# EAGLE schematic Controle_Des_Moteurs (EAGLE 9.5.2)
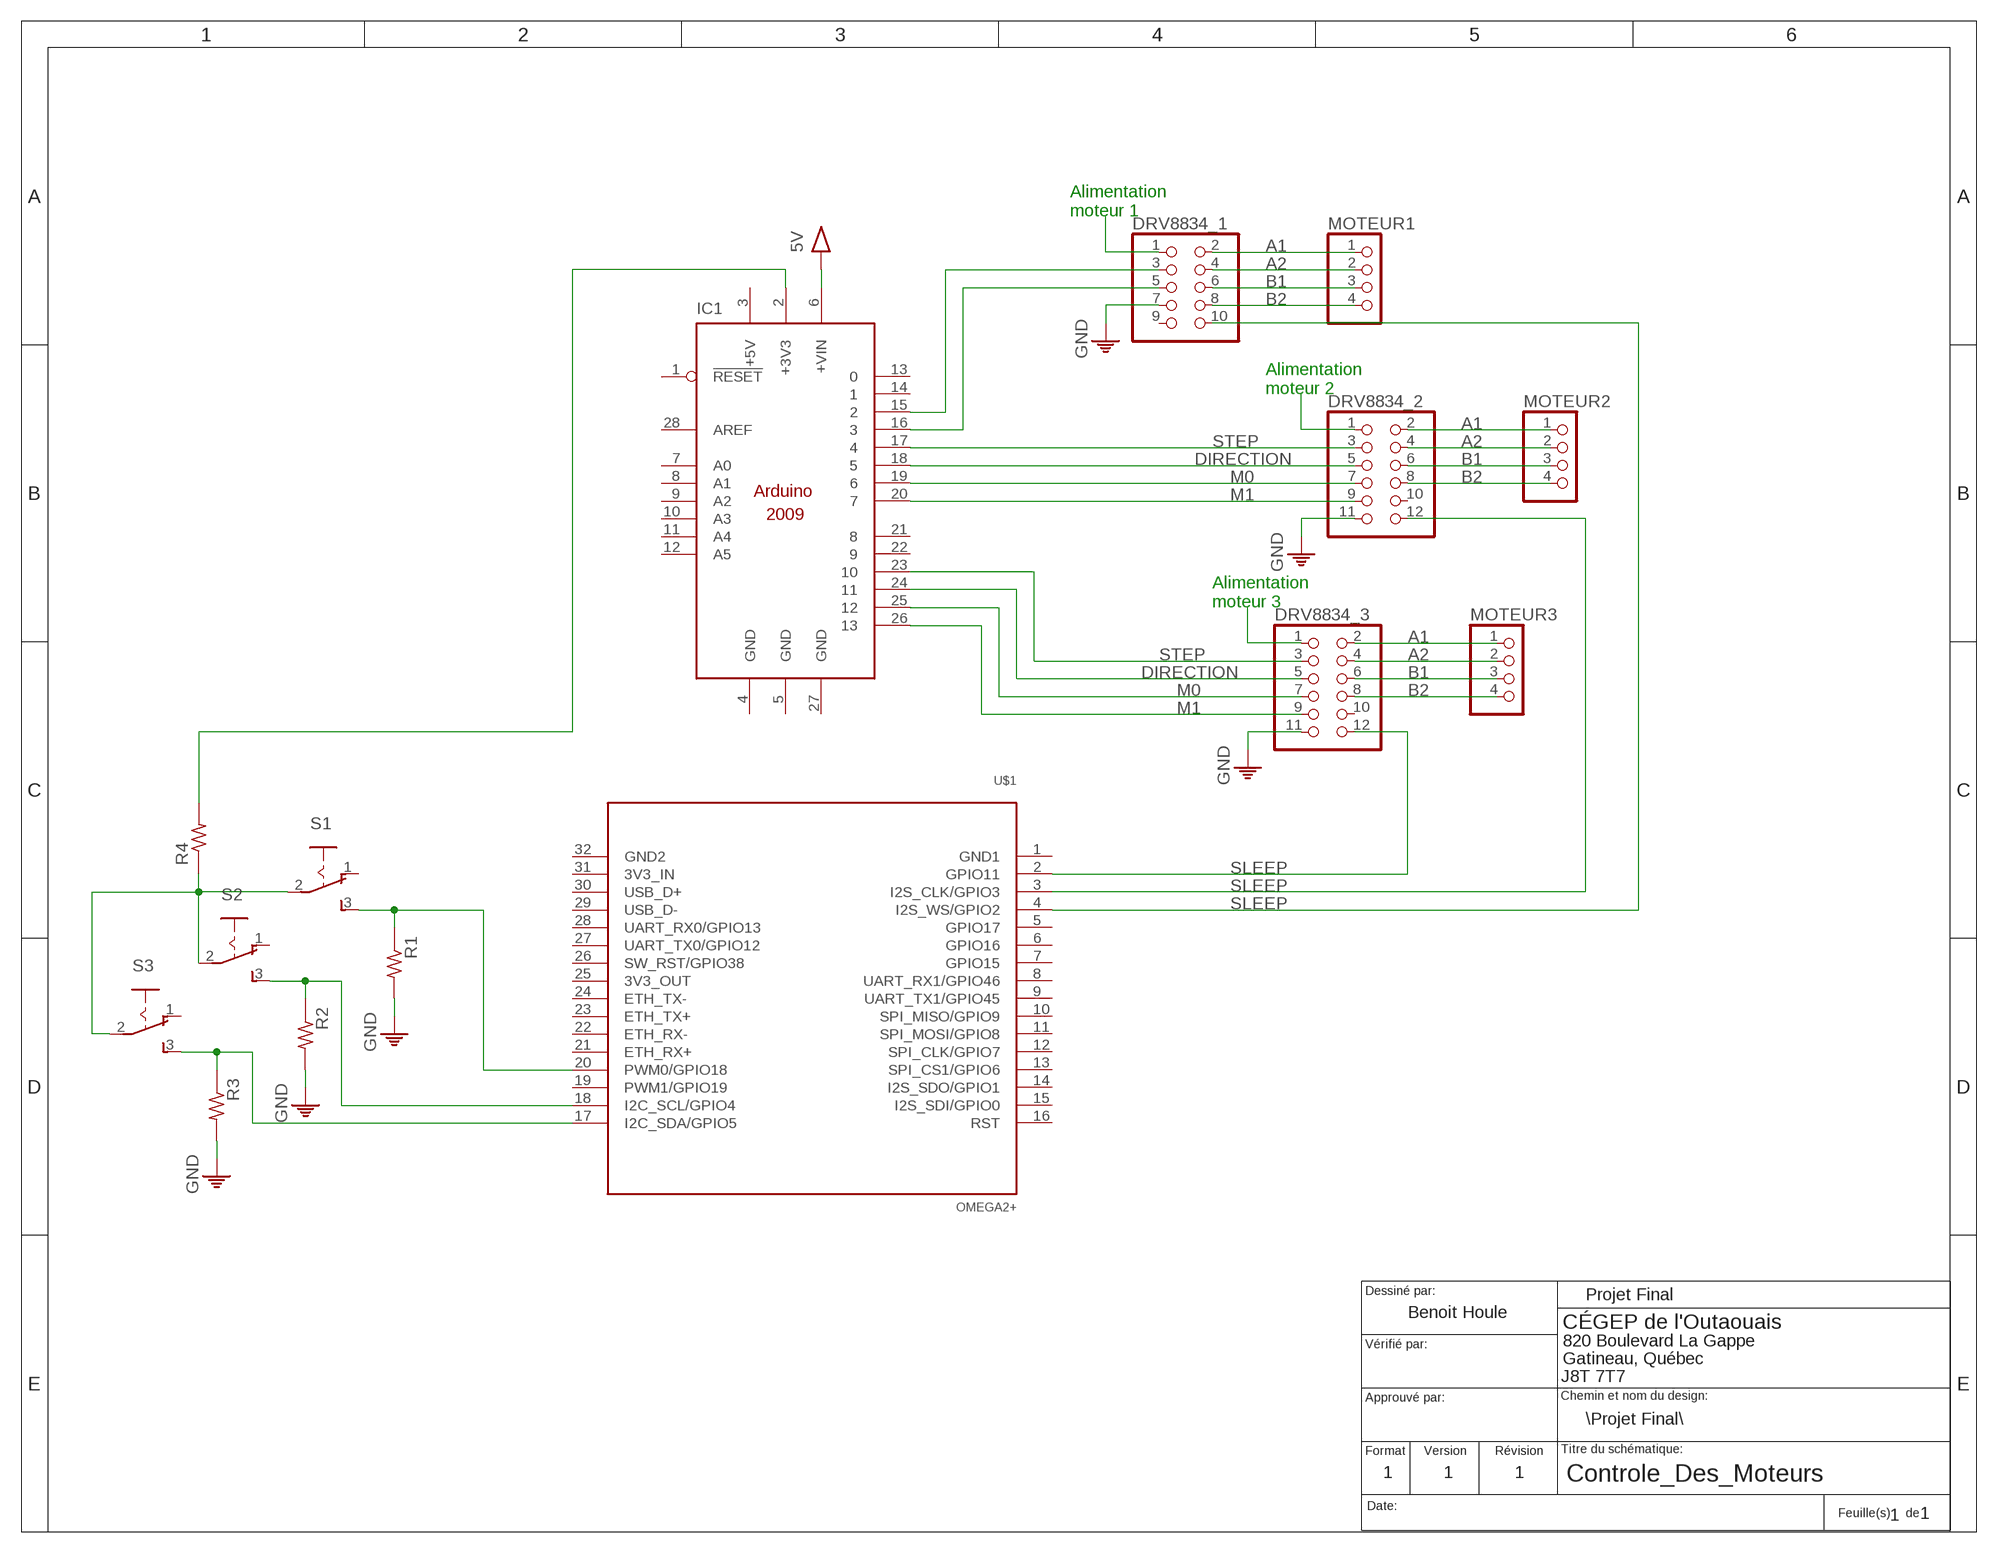
[diagram p0: schematic, sheet 1]

## Parts
DRV8834_1  PINHD-2X5  [2X05]
DRV8834_2  PINHD-2X6  [2X06]
DRV8834_3  PINHD-2X6  [2X06]
FRAME1  CARTOUCHE_TGÉ  [CARTOUCHE]
IC1  ARDUINO2009_10  [ARDUINO2009]
MOTEUR1  PINHD-1X4  [1X04]
MOTEUR2  PINHD-1X4  [1X04]
MOTEUR3  PINHD-1X4  [1X04]
R1  RMELF0207R  [MINI_MELF-0207R]
R2  RMELF0207R  [MINI_MELF-0207R]
R3  RMELF0207R  [MINI_MELF-0207R]
R4  RMELF0207R  [MINI_MELF-0207R]
S1  255SB  [255SB]
S2  255SB  [255SB]
S3  255SB  [255SB]
U$1  OMEGA2+  [OMEGA2_PADS]

## Nets
A1: DRV8834_1.2 DRV8834_2.2 DRV8834_3.2 MOTEUR1.1 MOTEUR2.1 MOTEUR3.1
A2: DRV8834_1.4 DRV8834_2.4 DRV8834_3.4 MOTEUR1.2 MOTEUR2.2 MOTEUR3.2
B1: DRV8834_1.6 DRV8834_2.6 DRV8834_3.6 MOTEUR1.3 MOTEUR2.3 MOTEUR3.3
B2: DRV8834_1.8 DRV8834_2.8 DRV8834_3.8 MOTEUR1.4 MOTEUR2.4 MOTEUR3.4
DIRECTION: DRV8834_2.5 DRV8834_3.5 IC1.18 IC1.24
M0: DRV8834_2.7 DRV8834_3.7 IC1.19 IC1.25
M1: DRV8834_2.9 DRV8834_3.9 IC1.20 IC1.26
N$1: DRV8834_1.1
N$2: DRV8834_2.1
N$3: DRV8834_1.3 IC1.15
N$4: DRV8834_1.5 IC1.16
N$5: DRV8834_3.1
N$6: R1.1 S1.3(S) U$1.20(PWM0/GPIO18)
N$7: R2.1 S2.3(S) U$1.18(I2C_SCL/GPIO4)
N$8: R3.1 S3.3(S) U$1.17(I2C_SDA/GPIO5)
N$9: R4.1 S1.2(P) S2.2(P) S3.2(P)
N$10: IC1.2(+3V3) R4.2
PE: DRV8834_1.7 DRV8834_2.11 DRV8834_3.11 R1.2 R2.2 R3.2 ; supply symbol labelled GND
SLEEP: DRV8834_1.10 DRV8834_2.12 DRV8834_3.12 U$1.2(GPIO11) U$1.3(I2S_CLK/GPIO3) U$1.4(I2S_WS/GPIO2)
STEP: DRV8834_2.3 DRV8834_3.3 IC1.17 IC1.23
VCC: IC1.6(+VIN) ; supply symbol labelled 5V
Unconnected: DRV8834_1.9 DRV8834_2.10 DRV8834_3.10 IC1.1(!RESET) IC1.7(A0) IC1.8(A1) IC1.9(A2) IC1.10(A3) IC1.11(A4) IC1.12(A5) IC1.13 IC1.14 IC1.21 IC1.22 IC1.28(AREF) S1.1(O) S2.1(O) S3.1(O) U$1.1(GND1) U$1.5(GPIO17) U$1.6(GPIO16) U$1.7(GPIO15) U$1.8(UART_RX1/GPIO46) U$1.9(UART_TX1/GPIO45) U$1.10(SPI_MISO/GPIO9) U$1.11(SPI_MOSI/GPIO8) U$1.12(SPI_CLK/GPIO7) U$1.13(SPI_CS1/GPIO6) U$1.14(I2S_SDO/GPIO1) U$1.15(I2S_SDI/GPIO0) U$1.16(RST) U$1.19(PWM1/GPIO19) U$1.21(ETH_RX+) U$1.22(ETH_RX-) U$1.23(ETH_TX+) U$1.24(ETH_TX-) U$1.25(3V3_OUT) U$1.26(SW_RST/GPIO38) U$1.27(UART_TX0/GPIO12) U$1.28(UART_RX0/GPIO13) U$1.29(USB_D-) U$1.30(USB_D+) U$1.31(3V3_IN) U$1.32(GND2)

## Notes on the sheet
- Alimentation
  moteur 1
- Alimentation
  moteur 2
- Alimentation
  moteur 3
- Projet Final
- Benoit Houle
- \\Projet Final\\
- 1 | 1 | 1
- 1 | 1

## Power pins joined to a net without a drawn wire
+5V: IC1.3(+5V)
GND: IC1.4(GND) IC1.5(GND) IC1.27(GND)

## Library data of the parts
DRV8834_1 = pinhead:PINHD-2X5: PIN HEADER
DRV8834_2 DRV8834_3 = 1mylib:PINHD-2X6: PIN HEADER
FRAME1 = 1_TGE-sur G:CARTOUCHE_TGÉ: Cartouche de TGÉ: Grandeur A, dimention 8 1/2 x 11 pouces, orientation portrait. Les élèves doivent utiliser la commande TEXT pour placer les valeurs aux champs appropriés. Couche 100 Cartouche, ne pas oublier de créer cette couche! Size par défaut: 0,07 ou ajusté en conséquence si pas asez d'espace. Ratio: 8% Font: Vector. Voir la commande TEXT pour plus d'information.
IC1 = arduino:ARDUINO2009_1: The Arduino Duemilanove ("2009") is a microcontroller board based on the ATmega168 or ATmega328. - 14 digital input/output pins (of which 6 can be used as PWM outputs) - 6 analog inputs, a 16 MHz crystal oscillator - USB connection - power jack - ISP header - reset button It contains everything needed to support the microcontroller; simply connect it to a computer with a USB cable or power it with a AC-to-DC adapter or battery to get started http://arduino.cc/en/Main/ArduinoBoardDuemilanove
MOTEUR1-MOTEUR3 = 1mylib:PINHD-1X4: PIN HEADER
R1-R4 = 1_TGE-sur G:R: R
S1-S3 = switch:255SB: SLIDING SWITCH Distributor Buerklin, 11G810
U$1 = OnionOmega2:OMEGA2+: Onion Omega2+; FLASH: 32MB; RAM: 128MB